# EAGLE design frontend_v1 (EAGLE 7.1.0)
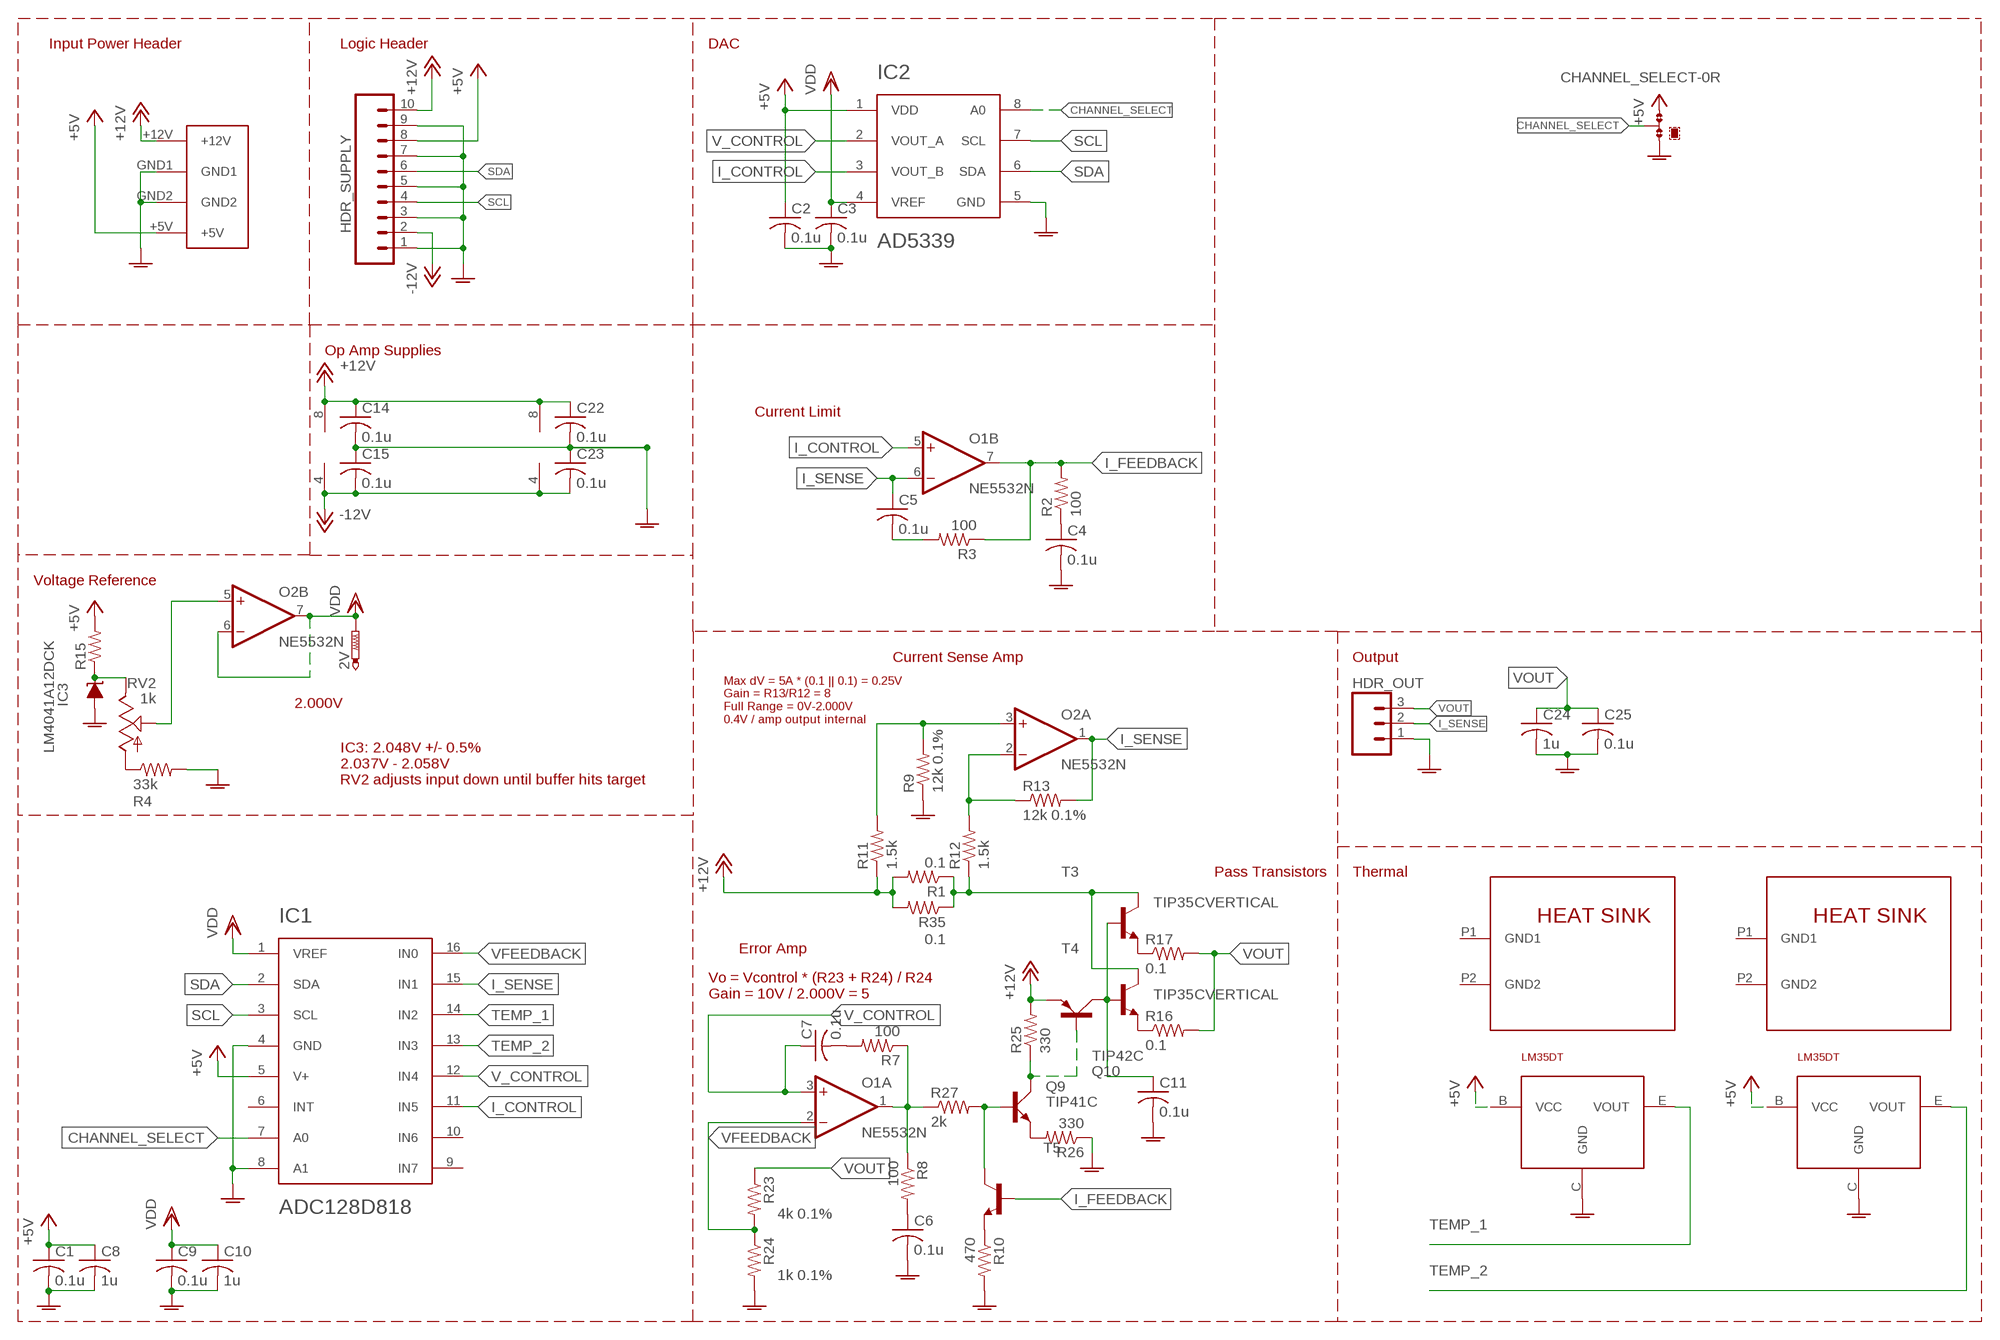
[diagram p0: schematic, sheet 1]

## Parts
2V  PTR1PAD1-17  [P1-17]
C1  0.1u  C-USC0805  [C0805]
C2  0.1u  C-USC0805  [C0805]
C3  0.1u  C-USC0805  [C0805]
C4  0.1u  C-USC0805  [C0805]
C5  0.1u  C-USC0805  [C0805]
C6  0.1u  C-USC0805  [C0805]
C7  0.1u  C-USC0805  [C0805]
C8  1u  C-USC0805  [C0805]
C9  0.1u  C-USC0805  [C0805]
C10  1u  C-USC0805  [C0805]
C11  0.1u  C-USC0805  [C0805]
C14  0.1u  C-USC0805  [C0805]
C15  0.1u  C-USC0805  [C0805]
C22  0.1u  C-USC0805  [C0805]
C23  0.1u  C-USC0805  [C0805]
C24  1u  C-USC1206  [C1206]
C25  0.1u  C-USC1206  [C1206]
CHANNEL_SELECT  0R-JUMPA  [A0R-JMP]
HDR_OUT  M03  [03P]
HDR_SUPPLY  M10  [10P]
IC1  ADC128D818  [TSSOP16]
IC2  AD5339MSOP8  [MSOP08]
IC3  LM4041A12DCK  [DCK_R-PDSO-G5]
O1  NE5532N  [DIL08]
O2  NE5532N  [DIL08]
Q9  TIP41C  [TO220AV]
Q10  TIP42C  [TO220AV]
R1  0.1  R-US_R2512  [R2512]
R2  100  R-US_M0805  [M0805]
R3  100  R-US_M0805  [M0805]
R4  33k  R-US_M0805  [M0805]
R7  100  R-US_M0805  [M0805]
R8  100  R-US_M0805  [M0805]
R9  12k 0.1%  R-US_M0805  [M0805]
R10  470  R-US_M0805  [M0805]
R11  1.5k  R-US_M0805  [M0805]
R12  1.5k  R-US_M0805  [M0805]
R13  12k 0.1%  R-US_M0805  [M0805]
R15  R-US_M0805  [M0805]
R16  0.1  R-US_R2512  [R2512]
R17  0.1  R-US_R2512  [R2512]
R23  4k 0.1%  R-US_M0805  [M0805]
R24  1k 0.1%  R-US_M0805  [M0805]
R25  330  R-US_M0805  [M0805]
R26  330  R-US_M0805  [M0805]
R27  2k  R-US_M0805  [M0805]
R35  0.1  R-US_R2512  [R2512]
RV2  1k  POTTRIM  [TRIM_POT]
T3  TIP35CVERTICAL  [TO247]
T4  TIP35CVERTICAL  [TO247]
T5  MMBT2222ALT1-NPN-SOT23-BEC  [SOT23-BEC]
U2  LM35DT  [TO220AV]
U3  LM35DT  [TO220AV]
U$1  MOLEX-8981  [MOLEX-8981-MALE]
U$2  FA-T220-X  [FA-T220-X]
U$3  FA-T220-X  [FA-T220-X]

## Nets
+5V: C1.1 C2.1 C8.1 CHANNEL_SELECT.3 HDR_SUPPLY.8 IC1.5(V+) IC2.1(VDD) R15.2 U2.B(VCC) U3.B(VCC) U$1.+5V
+12V: C14.1 C22.1 HDR_SUPPLY.10 O1.8(P:V+) O2.8(P:V+) Q10.E R1.2 R11.1 R25.2 R35.2 U$1.+12V
-12V: C15.2 C23.2 HDR_SUPPLY.2 O1.4(P:V-) O2.4(P:V-)
CHANNEL_SELECT: CHANNEL_SELECT.2 IC1.7(A0) IC2.8(A0)
GNDA: C1.2 C2.2 C3.2 C4.2 C6.2 C8.2 C9.2 C10.2 C11.2 C14.2 C15.1 C22.2 C23.1 C24.2 C25.2 CHANNEL_SELECT.1 HDR_OUT.1 HDR_SUPPLY.1 HDR_SUPPLY.3 HDR_SUPPLY.5 HDR_SUPPLY.7 HDR_SUPPLY.9 IC1.4(GND) IC1.8(A1) IC2.5(GND) IC3.1(A) R4.2 R9.1 R10.2 R24.2 R26.1 U2.C(GND) U3.C(GND) U$1.GND1 U$1.GND2
I_CONTROL: IC1.11(IN5) IC2.3(VOUT_B) O1.5(B:+IN)
I_FEEDBACK: O1.7(B:OUT) R2.2 R3.1 T5.B
I_SENSE: C5.1 HDR_OUT.2 IC1.15(IN1) O1.6(B:-IN) O2.1(A:OUT) R13.2
N$1: C4.1 R2.1
N$2: C5.2 R3.2
N$3: O2.5(B:+IN) RV2.1(S)
N$4: R4.1 RV2.3(A)
N$5: C6.1 R8.2
N$6: Q9.B R27.2 T5.C
N$7: C7.2 R7.2
N$15: O2.3(A:+IN) R9.2 R11.2
N$16: O2.2(A:-IN) R12.2 R13.1
N$17: R10.1 T5.E
N$18: R16.1 T4.P3(E)
N$19: R17.1 T3.P3(E)
N$20: R1.1 R12.1 R35.1 T3.P2(C) T4.P2(C)
N$30: Q9.C Q10.B R25.1
N$31: Q9.E R26.2
N$32: O1.1(A:OUT) R7.1 R8.1 R27.1
N$38: IC3.3(C) R15.1 RV2.2(E)
SCL: HDR_SUPPLY.4 IC1.3(SCL) IC2.7(SCL)
SDA: HDR_SUPPLY.6 IC1.2(SDA) IC2.6(SDA)
TEMP_1: IC1.14(IN2) U2.E(VOUT)
TEMP_2: IC1.13(IN3) U3.E(VOUT)
V_CONTROL: C7.1 IC1.12(IN4) IC2.2(VOUT_A) O1.3(A:+IN)
VDD: 2V.TP C3.1 C9.1 C10.1 IC1.1(VREF) IC2.4(VREF) O2.6(B:-IN) O2.7(B:OUT)
VFEEDBACK: IC1.16(IN0) O1.2(A:-IN) R23.2 R24.1
VOUT: C24.1 C25.1 HDR_OUT.3 R16.2 R17.2 R23.1
VREF: C11.1 Q10.C T3.P1(B) T4.P1(B)
Unconnected: IC1.6(INT) IC1.9(IN7) IC1.10(IN6) U$2.P1(GND1) U$2.P2(GND2) U$3.P1(GND1) U$3.P2(GND2)

## Notes on the sheet
- Input Power Header | Logic Header | DAC
- Op Amp Supplies
- Current Limit
- Voltage Reference
- Current Sense Amp | Output
- 2.000V
- Max dV = 5A * (0.1 || 0.1) = 0.25V
  Gain = R13/R12 = 8
  Full Range = 0V-2.000V
  0.4V / amp output internal
- IC3: 2.048V +/- 0.5%
  2.037V - 2.058V
  RV2 adjusts input down until buffer hits target
- Pass Transistors | Thermal
- Error Amp
- Vo = Vcontrol * (R23 + R24) / R24
  Gain = 10V / 2.000V = 5

## Library data of the parts
2V = testpad:PTR1: TEST PIN
C1-C11 C14 C15 C22-C25 = rcl:C-US: CAPACITOR, American symbol
CHANNEL_SELECT = jump-0r-smd:0R-JUMP: SMD 0R 0805 Jumper
HDR_OUT = con-amp-quick:M03: AMP QUICK CONNECTOR; OC_FARNELL: unknown; OC_NEWARK: unknown
HDR_SUPPLY = con-amp-quick:M10: AMP QUICK CONNECTOR; OC_FARNELL: unknown; OC_NEWARK: unknown
IC1 = parts:ADC128D818
IC2 = parts:AD5339
IC3 = texas:LM4041: PRECISION MICROPOWER SHUNT VOLTAGE REFERENCE Source: http://focus.ti.com/lit/ds/slcs146e/slcs146e.pdf; MPN: LM4041A12IDCKR; OC_FARNELL: unknown; OC_NEWARK: 58K5877
O1 O2 = linear:NE5532: AUDIO AMPLIFIER
Q9 = transistor-power:TIP41C: NPN TRANSISTOR
Q10 = transistor-power:TIP42C: PNP TRANSISTOR
R1-R4 R7-R13 R15-R17 R23-R27 R35 = rcl:R-US_: RESISTOR, American symbol
RV2 = SparkFun-Electromechanical:POT
T3 T4 = parts:TIP35C
T5 = transistor:*-NPN-: NPN Transistror BF959 corrected 2008.03.06
U2 U3 = parts:LM35DT
U$1 = parts:MOLEX-8981
U$2 U$3 = parts:FA-T220-X

## Board
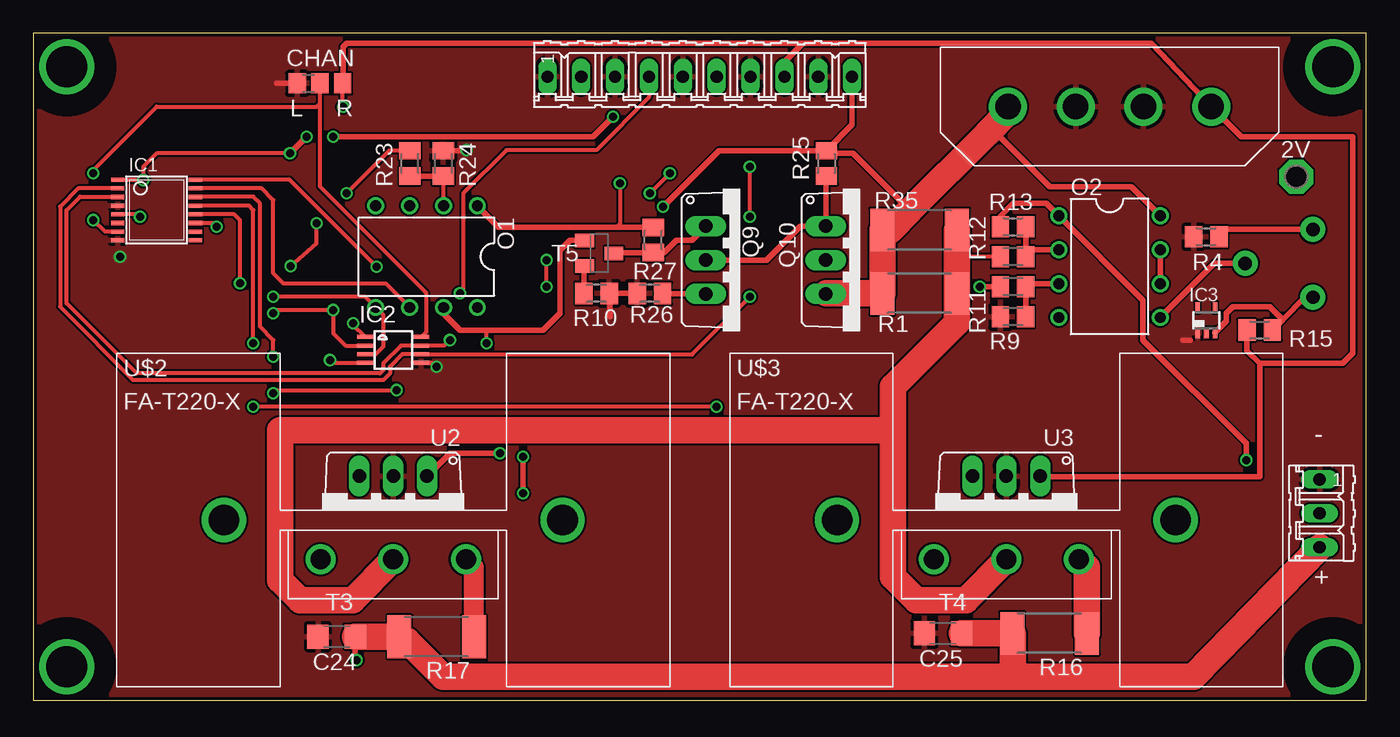
[diagram p1: board, top side]
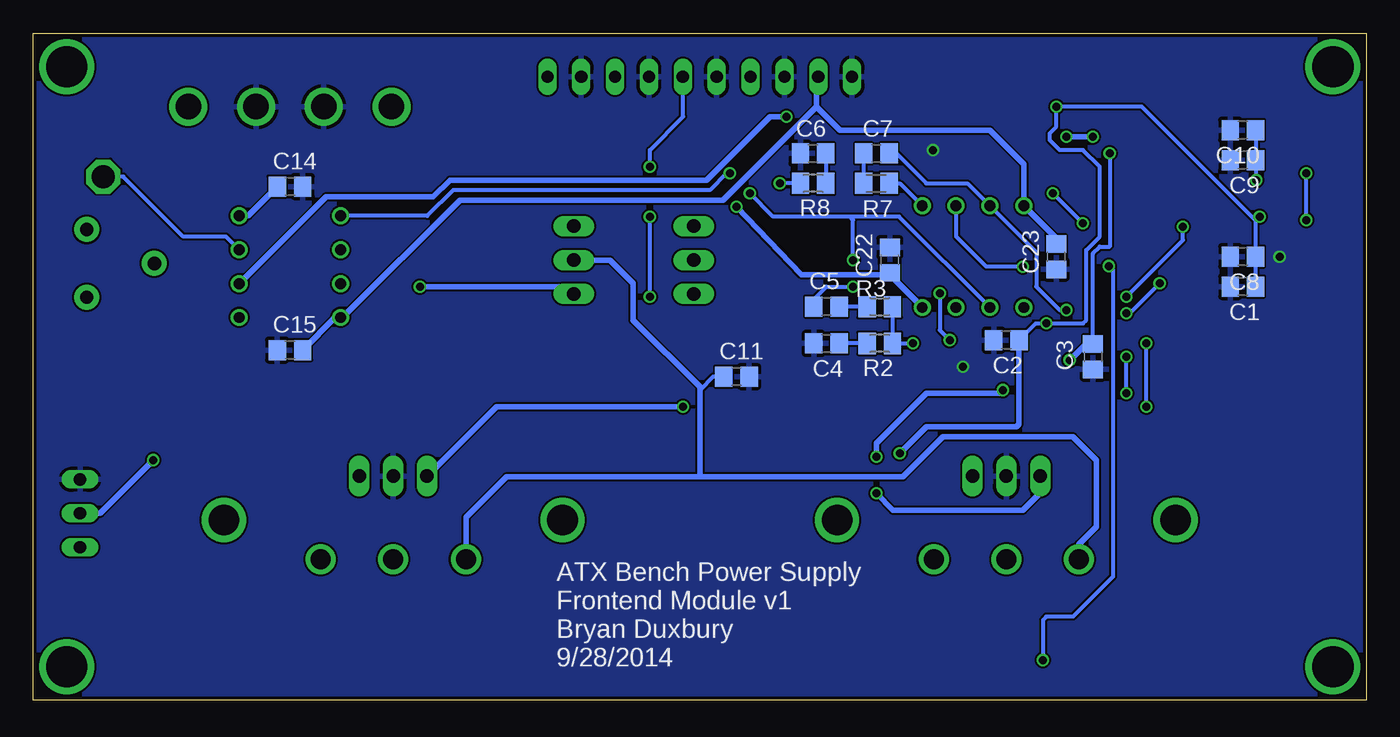
[diagram p2: board, bottom side, seen from below]

Size 100 x 50 mm. Coordinates in mm from the lower left corner, seen from the top.
Outline: 0,0 100,0 100,50 0,50 0,0
Copper layers (1*16): Top 0.035mm / dielectric 0.2mm / Bottom 0.035mm
Design rules "SeeedStudio_DRU_no_angle_20130527 *": minimum track width 6mil, minimum drill 12mil, track to track 6mil, track to pad 6mil, pad to pad 6mil, via to via 6mil, smd to smd 0mil, copper to edge 10mil, drill to drill 10mil, minimum pad ring 6mil, minimum via ring 6mil, stop-mask expansion 2mil, vias tented up to drill 25mil, thermal gap 10mil
tRestrict: area 94,44 to 101,51; area -1,44 to 6,51; area -1,-1 to 6,6; area 94,-1 to 101,6

### Footprints (pad centres in the part's own frame; a part is rotated, then mirrored left to right if it is on the bottom)
P1-17 = drill 1.702 pad 2.54 octagon: TP 0,0
C0805 = smd 1.3 x 1.5: 1 -0.95,0; 2 0.95,0
C1206 = smd 1.6 x 1.8: 1 -1.4,0; 2 1.4,0
A0R-JMP = smd 1.5 x 1.3: 1 0,1.7; 2 0,0; 3 0,-1.7
03P = drill 0.914 long: 1 -2.54,0; 2 0,0; 3 2.54,0
10P = drill 0.914 long: 1 -11.43,0; 2 -8.89,0; 3 -6.35,0; 4 -3.81,0; 5 -1.27,0; 6 1.27,0; 7 3.81,0; 8 6.35,0; 9 8.89,0; 10 11.43,0
TSSOP16 = smd 0.305 x 0.991: 1 -2.275,-2.918; 2 -1.625,-2.918; 3 -0.975,-2.918; 4 -0.325,-2.918; 5 0.325,-2.918; 6 0.975,-2.918; 7 1.625,-2.918; 8 2.275,-2.918; 9 2.275,2.918; 10 1.625,2.918; 11 0.975,2.918; 12 0.325,2.918; 13 -0.325,2.918; 14 -0.975,2.918; 15 -1.625,2.918; 16 -2.275,2.918
MSOP08 = smd 0.3 x 1.2: 1 -0.976,-2.113; 2 -0.326,-2.113; 3 0.324,-2.113; 4 0.974,-2.113; 5 0.974,2.112; 6 0.324,2.112; 7 -0.326,2.112; 8 -0.976,2.112
DCK_R-PDSO-G5 = smd 0.35 x 0.8: 1 -0.65,-0.95; 2 0,-0.95; 3 0.65,-0.95; 4 0.65,0.95; 5 -0.65,0.95
DIL08 = drill 0.813 pad 1.27: 1 -3.81,-3.81; 2 -1.27,-3.81; 3 1.27,-3.81; 4 3.81,-3.81; 5 3.81,3.81; 6 1.27,3.81; 7 -1.27,3.81; 8 -3.81,3.81
TO220AV = drill 1.016 long: B -2.54,-2.54; C 0,-2.54; E 2.54,-2.54
R2512 = smd 1.8 x 3.2: 1 -2.8,0; 2 2.8,0
M0805 = smd 1.3 x 1.6: 1 -0.95,0; 2 0.95,0
TRIM_POT = drill 1 pad 1.88: 1 5.08,0; 2 0,2.54; 3 0,-2.54
TO247 = drill 1.5: P1 -5.45,-2.2; P2 0,-2.2; P3 5.45,-2.2
SOT23-BEC = smd 1 x 1.4: B -0.95,-1.1; C 0,1.1; E 0.95,-1.1
MOLEX-8981-MALE = drill 1.905: +5V 7.62,0; +12V -7.62,0; GND1 -2.54,0; GND2 2.54,0
FA-T220-X = drill 2.3: P1 -12.7,0; P2 12.7,0

### Placement (x,y rotation side)
2V  94.75,39.25 0 top
C1  9.25,31 180 bottom
C2  27,27 180 bottom
C3  20.5,25.75 270 bottom
C4  40.5,26.75 180 bottom
C5  40.5,29.5 0 bottom
C6  41.5,41 180 bottom
C7  36.75,41 180 bottom
C8  9.25,33.25 180 bottom
C9  9.25,40.5 180 bottom
C10  9.25,42.75 180 bottom
C11  47.25,24.25 0 bottom
C14  80.75,38.5 0 bottom
C15  80.75,26.25 0 bottom
C22  35.75,33 90 bottom
C23  23.25,33.25 90 bottom
C24  22.75,4.75 180 top
C25  68.25,5 180 top
CHANNEL_SELECT  21.5,46.25 90 top
HDR_OUT  96.5,14 270 top
HDR_SUPPLY  50,46.75 0 top
IC1  9.25,36.75 270 top
IC2  27,26.25 270 top
IC3  88,28.5 0 top
O1  29.5,33.25 180 top
O2  80.75,32.5 270 top
Q9  53,33 270 top
Q10  62,33 270 top
R1  66.5,30.5 180 top
R2  36.5,26.75 0 bottom
R3  36.5,29.5 180 bottom
R4  88,34.75 180 top
R7  36.75,38.75 180 bottom
R8  41.5,38.75 0 bottom
R9  73.5,28.75 0 top
R10  42.25,30.5 0 top
R11  73.5,31 0 top
R12  73.5,33.25 0 top
R13  73.5,35.5 180 top
R15  92,27.75 180 top
R16  76.25,5 180 top
R17  30.25,4.75 180 top
R23  28.25,40.25 270 top
R24  30.75,40.25 90 top
R25  59.5,40.25 90 top
R26  46.25,30.5 0 top
R27  46.5,34.5 270 top
R35  66.5,35.25 180 top
RV2  96,32.75 180 top
T3  27,12.75 0 top
T4  73,12.75 0 top
T5  42.46,33.5 270 top
U2  27,14.25 180 top
U3  73,14.25 180 top
U$1  80.75,44.5 0 top
U$2  27,13.5 0 top
U$3  73,13.5 0 top

### Tracks (layer width: path | path; a pad name or v marks a point on that pad's centre or on a via)
+5V  (via drill 0.6)
  Top 0.3: IC2.1 24,28.11 v24,28.25 | v8,36.25 7.83,36.42 IC1.5 | v23.25,44.5 23.2,44.55 CHANNEL_SELECT.3
  Top 0.4: 57.75,49.25 83.87,49.25 U$1.+5V 90.62,42.25 99,42.25 99,26 98.25,25.25 92,25.25 | 57.75,49.25 56.35,47.85 HDR_SUPPLY.8 | CHANNEL_SELECT.3 23.25,46.3 23.25,49 23.5,49.25 57.75,49.25 | 92,25.25 91.05,26.2 R15.2 | U3.B 75.58,16.75 92,16.75 92,25.25
  Top 0.406: U2.B 31.25,18.5 v35,18.5
  Bottom 0.3: C2.1 24.8,28.25 v24,28.25 21.25,28.25 21,28.5 21,33.75 20,34.75 20,40 21.25,41.25 23,41.25 23.75,42 23.75,42.5 23.25,43 v23.25,44.5 16.85,44.5 8.3,35.95 | C1.1 C8.1 8.3,35.95 | 8.3,35.95 v8,36.25
  Bottom 0.4: 26.25,20.5 26.05,20.7 C2.1
  Bottom 0.406: v35,18.5 33,20.5 26.25,20.5
+12V  (via drill 0.6)
  Top 0.4: R25.2 61.43,43.13 HDR_SUPPLY.10 | R25.2 59.7,41 61.5,41 65.78,36.73 | O2.8 82.37,38.5 76.25,38.5 72.28,42.48 71.53,42.48 | R11.1 v71,31 | v47.25,37 51.45,41.2 R25.2
  Top 1.5: Q10.E 59.5,30.5 | 64.3,35.25 R35.2
  Top 2: R35.2 R1.2 59.5,30.5 | U$1.+12V 73.13,44.08 71.53,42.48 65.78,36.73 64.3,35.25
  Bottom 0.4: O1.8 35.75,31.88 | 35.75,31.88 C22.1 | C14.1 83.89,36.31 O2.8 | v71,31 60,31 Q10.E | 35.75,31.88 42.38,31.88 v47.25,37
-12V
  Bottom 0.4: C23.2 23.25,34.62 O1.4 25.69,40.19 28.25,42.75 39.5,42.75 41.25,44.5 | C15.2 77.36,28.69 O2.4 76.81,28.69 68,37.5 48.25,37.5 41.25,44.5 | 41.25,44.5 41.25,46.61 HDR_SUPPLY.2
CHANNEL_SELECT  (via drill 0.6)
  Top 0.3: IC2.8 29.5,27.61 29.5,30.5 21.5,38.5 21.5,44.75 | 21.5,44.75 CHANNEL_SELECT.2 | IC1.7 5.38,35.12 v4.5,36 | v4.5,39.5 4.5,39.75 9.25,44.5 21.25,44.5 21.5,44.75
  Bottom 0.3: v4.5,36 v4.5,39.5
GNDA  (via drill 0.6)
  Top 0.3: IC2.5 29.97,25.28 v30.25,25
  Top 0.4: R26.1 R10.2 43.25,30.45 43.25,28.75 | R9.1 72.5,28.7 | 86.8,27 86.25,27 | R4.2 87,34.8 | CHANNEL_SELECT.1 18.25,46.25 | C24.2 21.25,4.65 | R24.2 32.45,41.2 v32.5,41.25
  other vias: 6.5,33.25
  pour Bottom: 0,50 100,50 100,0 0,0
  pour Top: 0,50 100,50 100,0 0,0
I_CONTROL  (via drill 0.6)
  Top 0.3: IC2.3 25.68,25.93 26.25,26.5 26.25,28.88 O1.5 24.88,30.25 v18,30.25 | v13.75,35.5 13.47,35.77 IC1.11
  Bottom 0.3: v18,30.25 13.75,34.5 v13.75,35.5
I_FEEDBACK  (via drill 0.6)
  Top 0.3: v34,26.75 34,27.75
  Top 0.4: O1.7 30.77,28.98 32,27.75 34,27.75 38.25,27.75 39.5,29 39.5,33.75 40.25,34.5 41.31,34.5 T5.B
  Bottom 0.3: R3.1 R2.2 v34,26.75
I_SENSE  (via drill 0.6)
  Top 0.3: O1.6 26.42,31.25 18.75,31.25 18,32 18,37.5 17.12,38.38 IC1.15 | v46.25,38 v47.75,39.5 | v38.5,31 v38.5,33
  Top 0.4: R13.2 72.55,36.3 73.5,37.25 76,37.25 O2.1 83.25,30 83.25,27 91,19.25 v91,18
  Bottom 0.3: O1.6 35.04,36.25 38.75,36.25 | 38.75,36.25 44.5,36.25 v46.25,38 | O2.1 70.44,36.31 68.5,38.25 49.25,38.25 48,39.5 v47.75,39.5 | C5.1 41.45,30.05 40.5,31 v38.5,31 | v38.5,33 38.5,36 38.75,36.25
  Bottom 0.4: v91,18 95,14 HDR_OUT.2
N$1
  Bottom 0.3: R2.1 C4.1
N$2
  Bottom 0.3: R3.2 C5.2
N$3
  Top 0.4: O2.5 88.62,32.75 RV2.1
N$4
  Top 0.4: R4.1 89.49,35.29 RV2.3
N$5
  Bottom 0.3: C6.1 R8.2
N$6
  Top 0.4: T5.C 43.61,33.55 R27.2 47.3,33.55 48.25,34.5 49.42,34.5 Q9.B
N$7
  Bottom 0.3: R7.2 C7.2
N$15
  Top 0.4: O2.3 74.68,31.23 R11.2 R9.2
N$16
  Top 0.4: R13.1 R12.2 74.97,33.77 O2.2
N$17
  Top 0.4: T5.E 41.3,32.49 R10.1
N$18
  Top 2: T4.P3 79.05,9.95 R16.1
N$19
  Top 1.5: R17.1 33.05,9.95 T3.P3
N$20
  Top 0.3: R12.1 69.3,33.25
  Top 2: T4.P2 69.95,7.5 66.25,7.5 64.5,9.25 64.5,20.25 | 64.5,20.25 64.5,23.5 69.3,28.3 R1.1 69.3,33.25 R35.1 | T3.P2 23.95,7.5 20,7.5 18.5,9 18.5,20.25 64.5,20.25
N$26  (via drill 3.1 pad 3.81)
  other vias: 2.5,2.5
N$30
  Top 0.4: Q9.C 55,33 57.54,35.54 Q10.B 59.46,39.26 R25.1
N$31
  Top 0.4: R26.2 47.24,30.46 Q9.E
N$32  (via drill 0.6)
  Top 0.3: v44,38.75 44,35.7 43.75,35.45
  Top 0.4: O1.1 34.92,35.45 43.75,35.45 R27.1
  Bottom 0.3: R7.1 35,38.75 O1.1 | R8.1 v44,38.75
N$34  (via drill 3.1 pad 3.81)
  other vias: 97.5,2.5
N$36  (via drill 3.1 pad 3.81)
  other vias: 97.5,47.5
N$37  (via drill 3.1 pad 3.81)
  other vias: 2.5,47.5
N$38
  Top 0.4: R15.1 93.72,28.52 | 93.72,28.52 95.41,30.21 RV2.2 | IC3.3 89.5,28.4 89.5,29 90,29.5 92.75,29.5 93.72,28.52
SCL  (via drill 0.6)
  Top 0.3: HDR_SUPPLY.4 46.19,45.19 42.25,41.25 35.5,41.25 32.25,38 32.25,30.75 v32,30.5 | v31.25,27 30.83,26.58 IC2.7 27.58,26.58 26.25,25.25 26.25,24.75 26,24.5 7.75,24.5 2.5,29.75 2.5,36.75 3.5,37.75 6.31,37.75 IC1.3
  Bottom 0.3: v32,30.5 32,27.75 v31.25,27
SDA  (via drill 0.6)
  Top 0.3: v53.75,30.25 49.43,25.93 IC2.6 27.68,25.93 26.75,25 26.75,24.5 26.25,24 7.5,24 2,29.5 2,37 3.38,38.38 IC1.2 | v53.75,36.25 v53.75,40
  Bottom 0.3: v53.75,30.25 v53.75,36.25 | v53.75,40 53.75,41.25 51.25,43.75 51.25,46.73 HDR_SUPPLY.6
TEMP_1  (via drill 0.6)
  Top 0.3: v18,25.75 18,27 17,28 17,37.25 16.5,37.75 12.19,37.75 IC1.14 | v18,23 18.25,23.25 v27.25,23.25
  Top 0.4: v36.75,15.5 v36.75,18.25
  Bottom 0.3: v18,23 v18,25.75
  Bottom 0.4: U2.E 24.46,15.54 25.75,14.25 35.5,14.25 v36.75,15.5 | 33,23 27.5,23 v27.25,23.25
  Bottom 0.406: 33,23 36.75,19.25 v36.75,18.25
TEMP_2  (via drill 0.6)
  Top 0.3: v51.25,22 v16.5,22 | v16.5,26.75 16.5,36.75 16.18,37.08 IC1.13
  Bottom 0.3: v16.5,22 v16.5,26.75
  Bottom 0.406: U3.E 65.25,22 v51.25,22
V_CONTROL  (via drill 0.6)
  Top 0.3: IC2.2 23.42,26.58 22.5,27.5 v22.5,29.25 18.25,29.25 v18,29 | v15.5,31.25 15.5,36 15.07,36.42 IC1.12
  Bottom 0.3: v22.5,29.25 23,29.25 24.75,31 24.75,33.58 O1.3 29.92,38.75 33,38.75 35.25,41 C7.1 | v18,29 17.75,29 v15.5,31.25
VDD  (via drill 0.6)
  Top 0.3: v22.25,25.5 22.47,25.28 IC2.4 | IC1.1 6.36,39 v8.25,39 8.25,40 9.25,41 v19.25,41
  Top 0.4: O2.7 O2.6 | v43.5,43.75 42,42.25 v22.5,42.25 | v20.5,42.25 v19.25,41
  Bottom 0.3: C3.1 20.5,33.5 20,34 19.25,34 v19.25,41 | O2.7 85.54,34.75 88.75,34.75 93.25,39.25 2V.TP | C10.1 C9.1 8.3,39.05 v8.25,39
  Bottom 0.4: C3.1 21.05,26.7 v22.25,25.5 | O2.6 78.04,37.75 70,37.75 68.75,39 49.5,39 44.75,43.75 v43.5,43.75 | v22.5,42.25 v20.5,42.25
VFEEDBACK  (via drill 0.6)
  Top 0.3: R24.1 30.75,37.08 | v25.75,32.5 19.23,39.02 IC1.16
  Top 0.4: R23.2 R24.1 | 30.75,37.08 O1.2
  Bottom 0.3: v25.75,32.5 28.5,32.5 30.75,34.75 30.75,37.04 O1.2
VOUT  (via drill 0.6)
  Top 0.3: R23.1 26.7,41.2 v23.5,38 | v19.3,32.55 21.25,34.25 v21.25,35.75
  Top 0.4: v24.25,3 24.15,3.1 C24.1
  Top 1.5: 28.05,4.45 R17.2 | R16.2 73.5,4.95
  Top 2: C25.1 R16.2 | C24.1 R17.2 | HDR_OUT.3 87.04,1.75 73.5,1.75 | 73.5,1.75 30.75,1.75 28.05,4.45 | 73.5,4.95 73.5,1.75
  Bottom 0.3: v23.5,38 v21.25,35.75 | v24.25,3 24.25,6 24,6.25 22,6.25 19,9.25 19,32.25 v19.3,32.55
VREF
  Bottom 0.3: C11.1 49,24.25 50,23.25
  Bottom 0.4: Q10.C 56.75,33 55,31.25 55,28.5 50,23.5 50,23.25 50,16.75 | 50,16.75 64.5,16.75 67.55,13.7 T4.P1 | 50,16.75 34.75,16.75 31.75,19.75 22,19.75 20.25,18 20.25,13 21.55,11.7 T3.P1

### Text on the board
tPlace: CHAN | L R
tNames: - | +
bNames: ATX Bench Power Supply / Frontend Module v1 / Bryan Duxbury / 9/28/2014